# Altium project УШЯИ 687253.017 Э3.PrjPcb
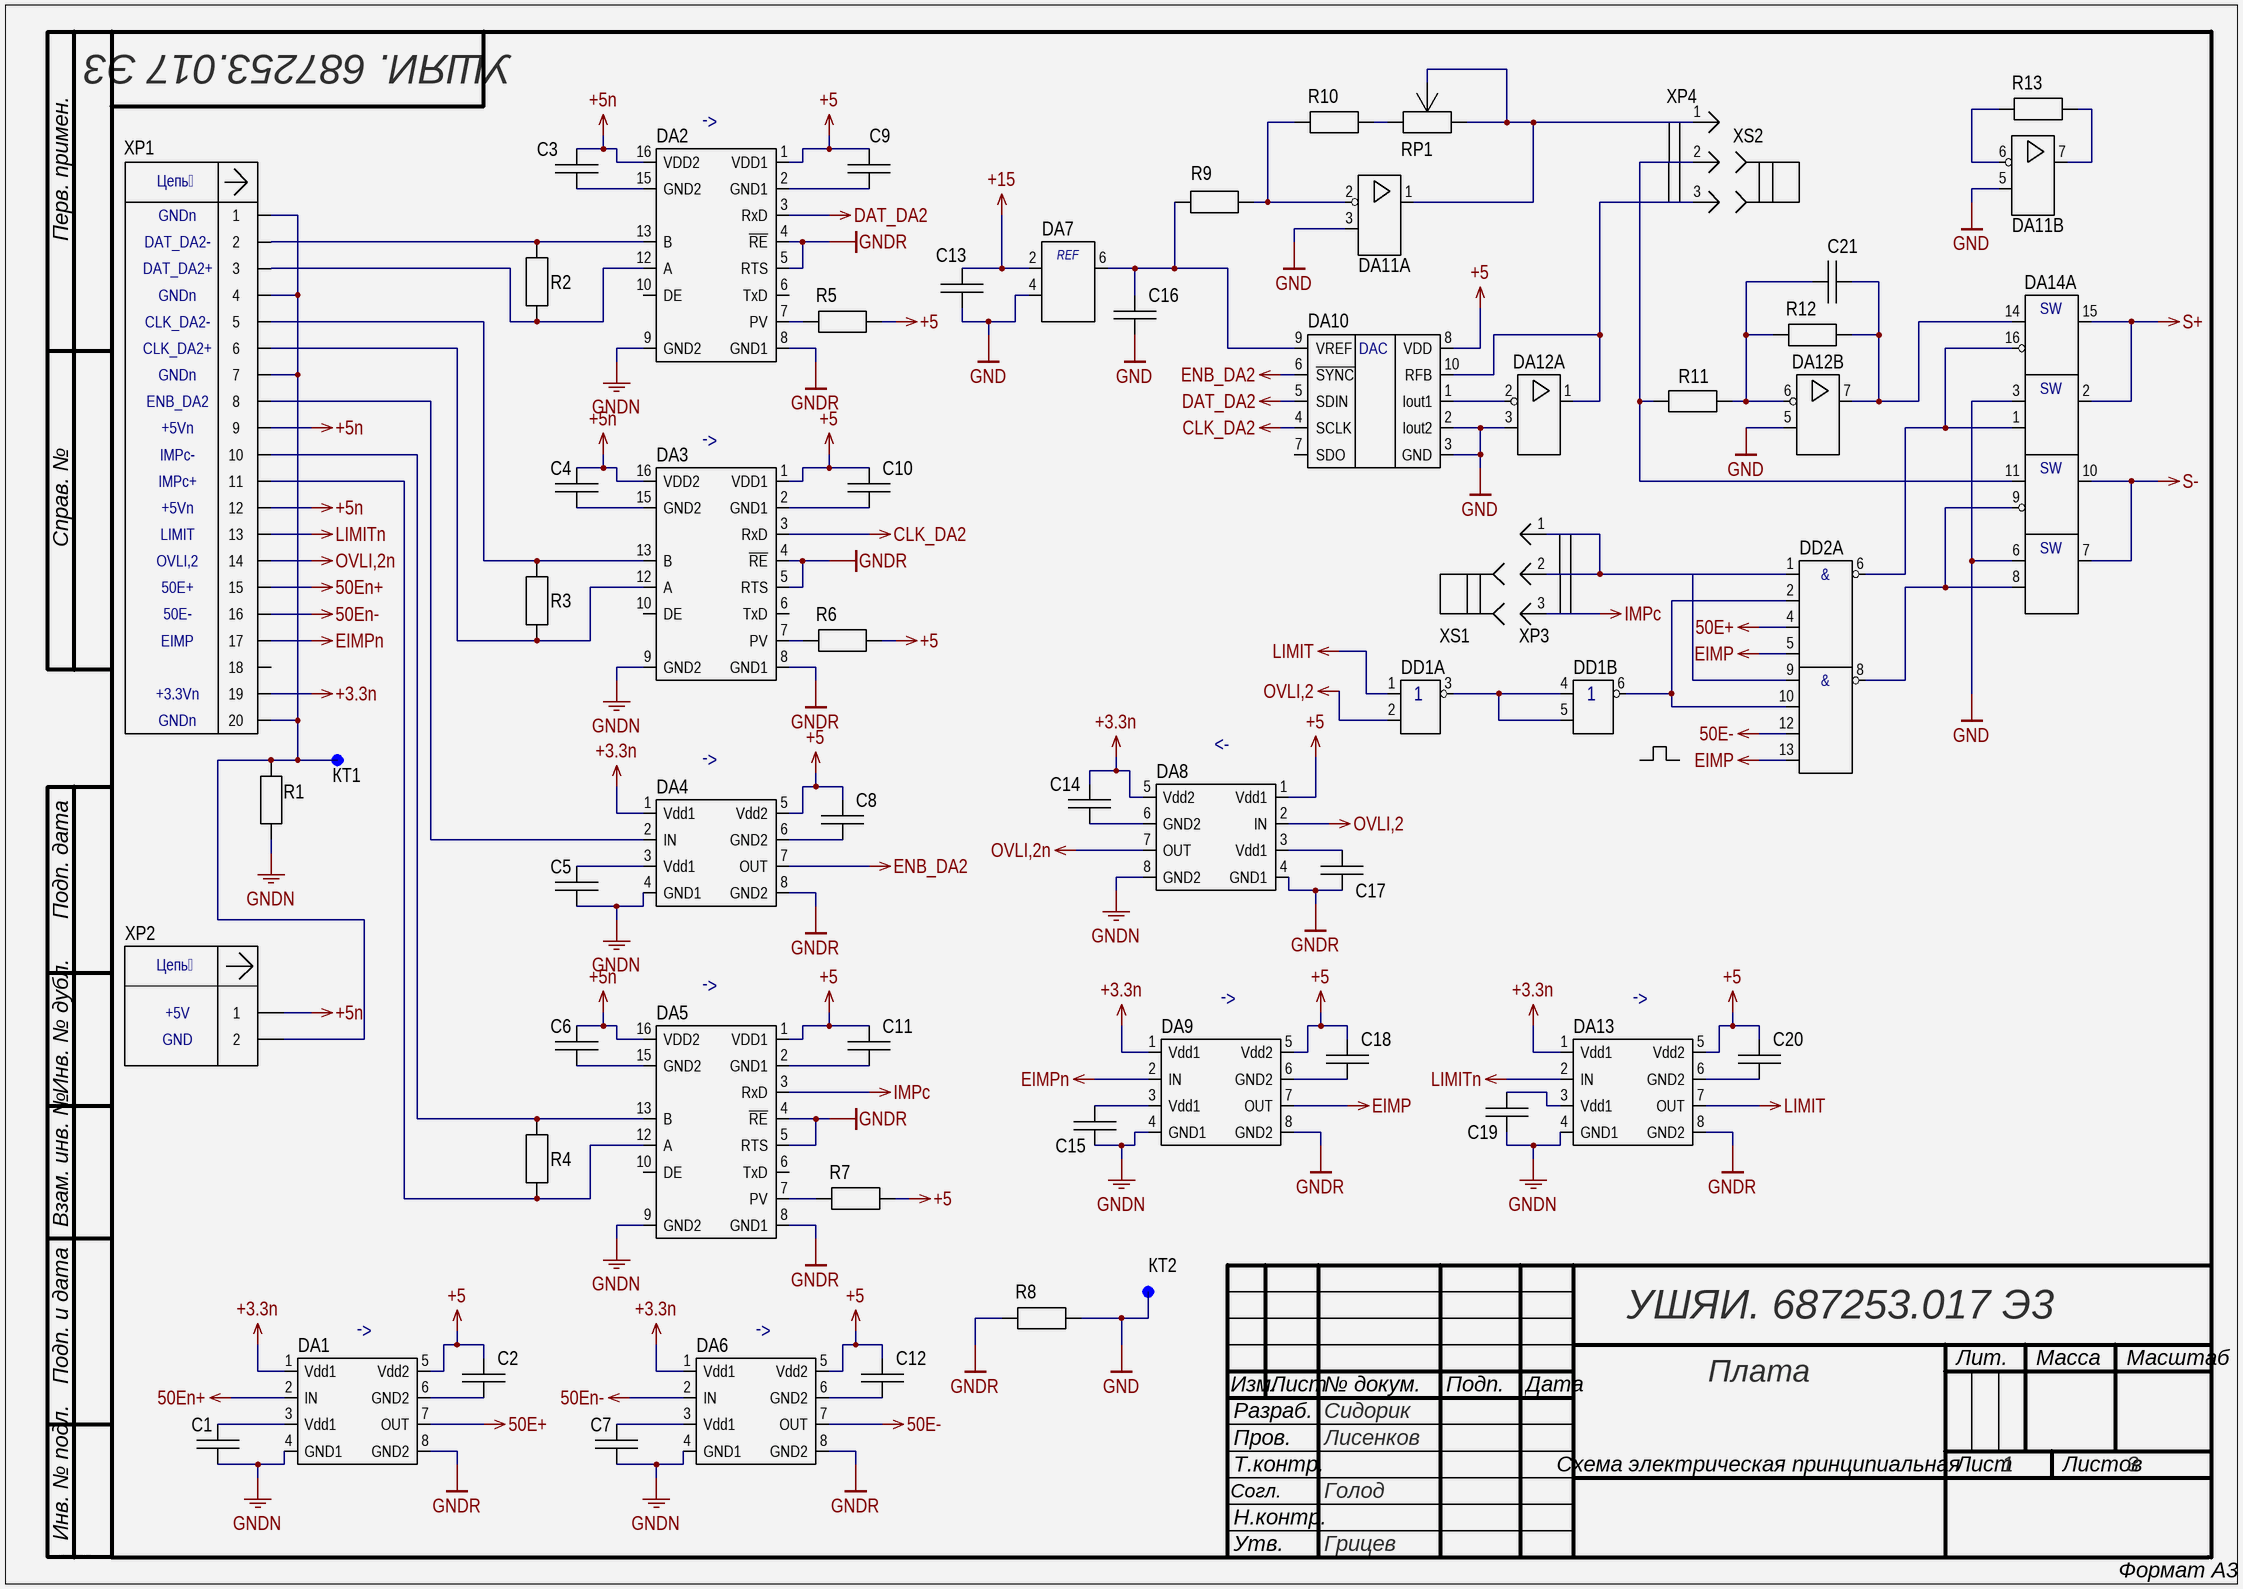
[diagram p0: Sheet1.SchDoc]
Вид_документа_SCH: Схема электрическая принципиальная; Наименование1: Плата; Обозначение_Код: УШЯИ. 687253.017 Э3; Характер_работы: Согл.; п_Доп_графа_Р: Голод; п_Пров_Р: Лисенков; п_Разраб_Р: Сидорик; п_Утв_Р: Грицев
2 sheets, 132 parts. Net scope: global (net labels, ports and power ports of the same name join across sheets).
Board files: PCB1.PcbDoc, PCB2.PcbDoc
Sheets:
  Sheet1.SchDoc
  Sheet2.SchDoc

## Sheet Sheet1.SchDoc
size 420 x 297 mm; SheetNumber: 1; SheetTotal: 3

### Parts
C1  0805-X7R-25 В-0,1 мкФ +-10%  [CAP: 0805]  (value not drawn)
C2  0805-X7R-25 В-0,1 мкФ +-10%  [CAP: 0805]  (value not drawn)
C3  0805-X7R-25 В-0,1 мкФ +-10%  [CAP: 0805]  (value not drawn)
C4  0805-X7R-25 В-0,1 мкФ +-10%  [CAP: 0805]  (value not drawn)
C5  0805-X7R-25 В-0,1 мкФ +-10%  [CAP: 0805]  (value not drawn)
C6  0805-X7R-25 В-0,1 мкФ +-10%  [CAP: 0805]  (value not drawn)
C7  0805-X7R-25 В-0,1 мкФ +-10%  [CAP: 0805]  (value not drawn)
C8  0805-X7R-25 В-0,1 мкФ +-10%  [CAP: 0805]  (value not drawn)
C9  0805-X7R-25 В-0,1 мкФ +-10%  [CAP: 0805]  (value not drawn)
C10  0805-X7R-25 В-0,1 мкФ +-10%  [CAP: 0805]  (value not drawn)
C11  0805-X7R-25 В-0,1 мкФ +-10%  [CAP: 0805]  (value not drawn)
C12  0805-X7R-25 В-0,1 мкФ +-10%  [CAP: 0805]  (value not drawn)
C13  0805-X7R-25 В-0,1 мкФ +-10%  [CAP: 0805]  (value not drawn)
C14  0805-X7R-25 В-0,1 мкФ +-10%  [CAP: 0805]  (value not drawn)
C15  0805-X7R-25 В-0,1 мкФ +-10%  [CAP: 0805]  (value not drawn)
C16  0805-X7R-25 В-0,1 мкФ +-10%  [CAP: 0805]  (value not drawn)
C17  0805-X7R-25 В-0,1 мкФ +-10%  [CAP: 0805]  (value not drawn)
C18  0805-X7R-25 В-0,1 мкФ +-10%  [CAP: 0805]  (value not drawn)
C19  0805-X7R-25 В-0,1 мкФ +-10%  [CAP: 0805]  (value not drawn)
C20  0805-X7R-25 В-0,1 мкФ +-10%  [CAP: 0805]  (value not drawn)
C21  1206-C0G-50 В-22 пФ +-5%  [CAP: 1206]  (value not drawn)
DA1  ADuM1100AR  [8-SOIC]  (value not drawn)
DA2  ADM2486BRWZ  [16-SOIC W]  (value not drawn)
DA3  ADM2486BRWZ  [16-SOIC W]  (value not drawn)
DA4  ADuM1100AR  [8-SOIC]  (value not drawn)
DA5  ADM2486BRWZ  [16-SOIC W]  (value not drawn)
DA6  ADuM1100AR  [8-SOIC]  (value not drawn)
DA7  ADR435BRZ  [8-SOIC]  (value not drawn)
DA8  ADuM1100AR  [8-SOIC]  (value not drawn)
DA9  ADuM1100AR  [8-SOIC]  (value not drawn)
DA10  AD5443YRM  [10-MSOP]  (value not drawn)
DA11  ADA4084-2ARZ  [8-SOIC]  (value not drawn)  (parts A,B of 3)
DA12  ADA4084-2ARZ  [8-SOIC]  (value not drawn)  (parts A,B of 3)
DA13  ADuM1100AR  [8-SOIC]  (value not drawn)
DA14  ADG433BR  [16-SOIC]  (value not drawn)  (part A of 2)
DD1  IN74HC00AD  [14-soic]  (value not drawn)  (parts A,B of 5)
DD2  IN74HC20D  [14-SOIC]  (value not drawn)  (part A of 2)
R1  1206-10 Ом+-5%  [1206]  (value not drawn)
R2  1206-100 Ом+-5%  [1206]  (value not drawn)
R3  1206-100 Ом+-5%  [1206]  (value not drawn)
R4  1206-100 Ом+-5%  [1206]  (value not drawn)
R5  1206-12 кОм+-5%  [1206]  (value not drawn)
R6  1206-12 кОм+-5%  [1206]  (value not drawn)
R7  1206-12 кОм+-5%  [1206]  (value not drawn)
R8  1206-10 Ом+-5%  [1206]  (value not drawn)
R9  1206-10 кОм+-0,5%  [1206]  (value not drawn)
R10  1206-100 Ом+-0,5%  [1206]  (value not drawn)
R11  1206-10 кОм+-0,5%  [1206]  (value not drawn)
R12  1206-10 кОм+-0,5%  [1206]  (value not drawn)
R13  1206-12 кОм+-1%  [1206]  (value not drawn)
RP1  3362P-1-103LF  [BOUR-3362P]  (value not drawn)
XP1  BH2-20  [DS1014-20]  (value not drawn)
XP2  280370-2  [280370-2]  (value not drawn)
XP3  DS1021-1x3  [3X2.54]  (value not drawn)
XP4  DS1021-1x3  [3X2.54]  (value not drawn)
XS1  Jumper, 2.54mm  (value not drawn)
XS2  Jumper, 2.54mm  (value not drawn)
КТ1  Lepestok  [LEPESTOK7750224]  (value not drawn)
КТ2  Lepestok  [LEPESTOK7750224]  (value not drawn)

### Nets
50E+: DA1.7(OUT) DD2.4(C1)
50E-: DA6.7(OUT) DD2.12(C2)
50En+: DA1.2(IN) XP1.15
50En-: DA6.2(IN) XP1.16
+3.3n: C14.1 DA1.1(Vdd1) DA4.1(Vdd1) DA6.1(Vdd1) DA8.5(Vdd2) DA9.1(Vdd1) DA13.1(Vdd1) XP1.19
+5: C2.1 C8.1 C9.2 C10.2 C11.2 C12.1 C18.1 C20.1 DA1.5(Vdd2) DA2.1(VDD1) DA3.1(VDD1) DA4.5(Vdd2) DA5.1(VDD1) DA6.5(Vdd2) DA8.1(Vdd1) DA9.5(Vdd2) DA10.8(VDD) DA13.5(Vdd2) R5.1 R6.1 R7.1
+5n: C3.2 C4.2 C6.2 DA2.16(VDD2) DA3.16(VDD2) DA5.16(VDD2) XP1.9 XP1.12 XP2.1
+15: C13.1 DA7.2(VIN)
CLK_DA2: DA3.3(RxD) DA10.4(SCLK)
DAT_DA2: DA2.3(RxD) DA10.5(SDIN)
EIMP: DA9.7(OUT) DD2.5(D1) DD2.13(D2)
EIMPn: DA9.2(IN) XP1.17
ENB_DA2: DA4.7(OUT) DA10.6(~{SYNC})
GND: C13.2 C16.1 DA7.4(GND) DA10.2(Iout2) DA10.3(GND) DA11.3(+IN_A) DA11.5(+IN_B) DA12.3(+IN_A) DA12.5(+IN_B) DA14.3(S1) DA14.6(S4) R8.2 КТ2.1
GNDN: C1.1 C5.1 C7.1 C15.1 C19.1 DA1.4(GND1) DA2.9(GND2) DA3.9(GND2) DA4.4(GND1) DA5.9(GND2) DA6.4(GND1) DA8.8(GND2) DA9.4(GND1) DA13.4(GND1) R1.1
GNDR: C17.1 DA1.8(GND2) DA2.4(~{RE}) DA2.5(RTS) DA2.8(GND1) DA3.4(~{RE}) DA3.5(RTS) DA3.8(GND1) DA4.8(GND2) DA5.4(~{RE}) DA5.5(RTS) DA5.8(GND1) DA6.8(GND2) DA8.4(GND1) DA9.8(GND2) DA13.8(GND2) R8.1
IMPc: DA5.3(RxD) XP3.3
LIMIT: DA13.7(OUT) DD1.1(A1)
LIMITn: DA13.2(IN) XP1.13
OVLI,2: DA8.2(IN) DD1.2(B1)
OVLI,2n: DA8.7(OUT) XP1.14
S+: DA14.2(D1) DA14.15(D2)
S-: DA14.7(D4) DA14.10(D3)
NetC1_2: C1.2 DA1.3(Vdd1)
NetC2_2: C2.2 DA1.6(GND2)
NetC3_1: C3.1 DA2.15(GND2)
NetC4_1: C4.1 DA3.15(GND2)
NetC5_2: C5.2 DA4.3(Vdd1)
NetC6_1: C6.1 DA5.15(GND2)
NetC7_2: C7.2 DA6.3(Vdd1)
NetC8_2: C8.2 DA4.6(GND2)
NetC9_1: C9.1 DA2.2(GND1)
NetC10_1: C10.1 DA3.2(GND1)
NetC11_1: C11.1 DA5.2(GND1)
NetC12_2: C12.2 DA6.6(GND2)
NetC14_2: C14.2 DA8.6(GND2)
NetC15_2: C15.2 DA9.3(Vdd1)
NetC16_2: C16.2 DA7.6(VOUT) DA10.9(VREF) R9.1
NetC17_2: C17.2 DA8.3(Vdd1)
NetC18_2: C18.2 DA9.6(GND2)
NetC19_2: C19.2 DA13.3(Vdd1)
NetC20_2: C20.2 DA13.6(GND2)
NetC21_1: C21.1 DA12.6(-IN_B) R11.2 R12.1
NetC21_2: C21.2 DA12.7(OUT_B) DA14.14(S2) R12.2
NetDA2_7: DA2.7(PV) R5.2
NetDA2_12: DA2.12(A) R2.1 XP1.3
NetDA2_13: DA2.13(B) R2.2 XP1.2
NetDA3_7: DA3.7(PV) R6.2
NetDA3_12: DA3.12(A) R3.1 XP1.6
NetDA3_13: DA3.13(B) R3.2 XP1.5
NetDA4_2: DA4.2(IN) XP1.8
NetDA5_7: DA5.7(PV) R7.2
NetDA5_12: DA5.12(A) R4.1 XP1.11
NetDA5_13: DA5.13(B) R4.2 XP1.10
NetDA10_1: DA10.1(Iout1) DA12.2(-IN_A)
NetDA10_10: DA10.10(RFB) DA12.1(OUT_A) XP4.3
NetDA11_1: DA11.1(OUT_A) RP1.1 RP1.2(WIPER) XP4.1
NetDA11_2: DA11.2(-IN_A) R9.2 R10.1
NetDA11_6: DA11.6(-IN_B) R13.1
NetDA11_7: DA11.7(OUT_B) R13.2
NetDA14_1: DA14.1(IN1) DA14.16(IN2) DD2.6(Y1)
NetDA14_8: DA14.8(IN4) DA14.9(IN3) DD2.8(Y2)
NetDA14_11: DA14.11(S3) R11.1 XP4.2
NetDD1_3: DD1.3(Y1) DD1.4(A2) DD1.5(B2)
NetDD1_6: DD1.6(Y2) DD2.2(B1) DD2.10(B2)
NetDD2_1: DD2.1(A1) DD2.9(A2) XP3.1 XP3.2
NetR1_2: R1.2 XP1.1 XP1.4 XP1.7 XP1.20 XP2.2 КТ1.1
NetR10_2: R10.2 RP1.3

Not connected (* = marked no-connect by the designer): DA2 6(TxD) 10(DE); DA3 6(TxD) 10(DE); DA5 6(TxD) 10(DE); DA10 7(SDO); XP1 18

### Notes on the sheet
- (near DA2) <-
- (near XP1) DAT_DA2-
- GNDn
- (near XP1) 1
- (near XP1) 2
- (near XP1) DAT_DA2+
- (near XP1) CLK_DA2-
- (near XP1) 3
- (near XP1) 4
- (near XP1) 5
- (near XP1) CLK_DA2+
- (near XP1) ENB_DA2
- (near XP1) 6
- (near XP1) 7
- (near XP1) 8
- IMPc-
- +5Vn
- (near XP1) 9
- (near XP1) 10
- (near DA3) <-
- IMPc+
- LIMIT
- (near XP1) 11
- (near XP1) 12
- (near XP1) 13
- OVLI,2
- 50E+
- (near XP1) 14
- (near XP1) 15
- EIMP
- 50E-
- (near XP1) 16
- (near XP1) 17
- (near XP1) 18
- +3.3Vn
- (near XP1) 19
- (near XP1) 20
- (near DA4) <-
- (near DA8) <-
- (near DA5) <-
- (near DA9) <-
- (near DA13) <-
- +5V
- GND
- (near DA1) <-
- (near DA6) <-
- Перв. примен.
- Справ. №
- Подп. дата
- Инв. № дубл.
- Взам. инв. №
- Подп. и дата
- Изм.
- Разраб.
- Лист
- № докум.
- Подп.
- Дата
- Лит.
- Масса
- Масштаб
- Пров.
- Т.контр.
- Листов
- Инв. № подл.
- Н.контр.
- Утв.
- ALTIUM GOSTBOM2.0 KEV
- Формат А3
- (in symbol 280370-2) Цепь
- (in symbol AD5443YRM) DAC
- (in symbol ADG433BR_1, part A) SW
- (in symbol ADR435BRZ) REF
- (in symbol BH2-20) Цепь
- (in symbol IN74HC20D_1, part A) &

### Library data of the parts
C1-C20 = 0805-X7R-25 В-0,1 мкФ +-10%: Value: 0,1 мкФ
C21 = 1206-C0G-50 В-22 пФ +-5%: Value: 22 пФ
DA2 DA3 DA5 = ADM2486BRWZ: Isolated RS-485 Transceiver,  20 Mbps data rate, SOIC-16-W
DA10 = AD5443YRM: 12-Bit High Bandwidth / Multiplying DACs with Serial Interface / 10-MSOP
DA11 DA12 = ADA4084-2ARZ: 30 V, Low Noise, Rail-to-Rail Input/Output, / Low Power Operational Amplifiers
DA14 = ADG433BR_1: LC2MOS Precision Quad SPST Switches; Value: *
DD1 = IN74HC00AD: Quad 2-Input NAND Gate High-Performance Silicon-Gate CMOS.
DD2 = IN74HC20D_1: Dual 4-input  NAND Gate CMOS
R1 R8 = 1206-10 Ом+-5%: Value: 10 Ом; ModelPrint: 1206
R2-R4 = 1206-100 Ом+-5%: Value: 100 Ом; ModelPrint: 1206
R5-R7 = 1206-12 кОм+-5%: Value: 12 кОм; ModelPrint: 1206
R9 R11 R12 = 1206-10 кОм+-0,5%: Value: 10 кОм; ModelPrint: 1206
R10 = 1206-100 Ом+-0,5%: Value: 100 Ом; ModelPrint: 1206
R13 = 1206-12 кОм+-1%: Value: 12 кОм; ModelPrint: 1206
RP1 = 3362P-1-103LF: 3362 -1/4 ˝ Square Trimpot® Trimming Potentiometer
XP1 = BH2-20: IDC2-20MS DS1014 20 pin
XP2 = 280370-2: Connector
XP3 XP4 = DS1021-1x3_1: PLS-3, 2.54 pitch; 1: *; 2: *; 3: *

## Sheet Sheet2.SchDoc
size 420 x 297 mm; SheetNumber: 2; SheetTotal: 3
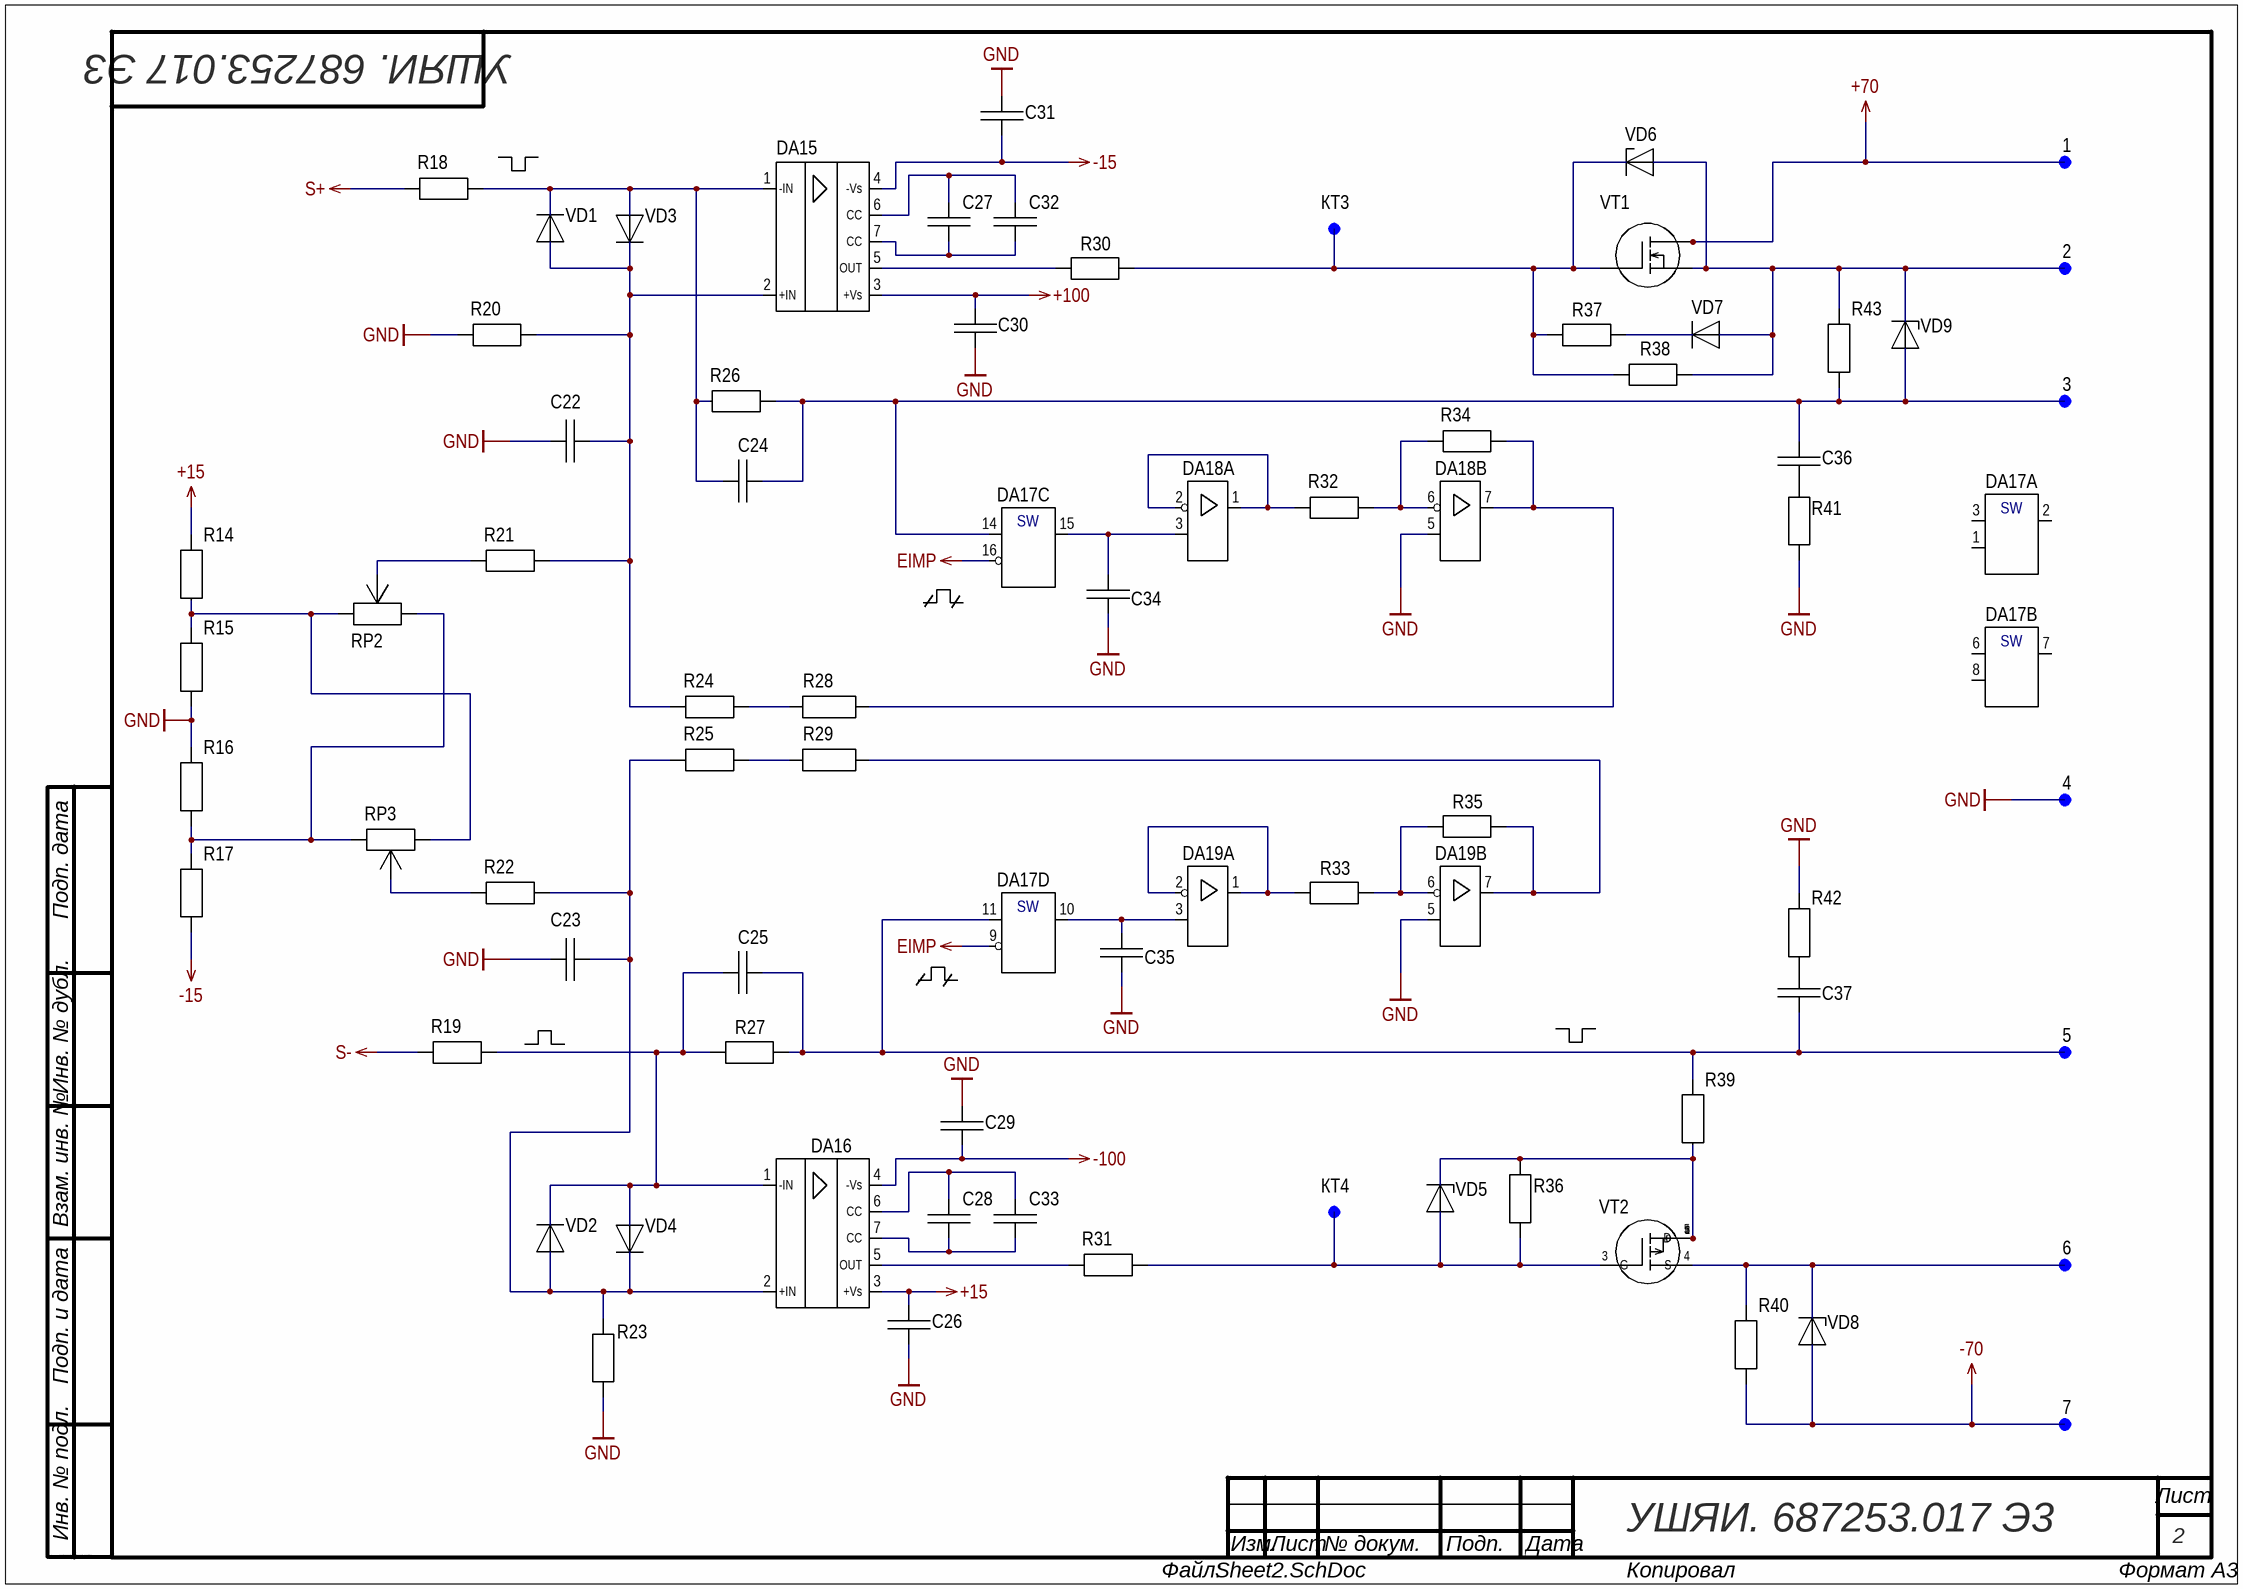
[diagram p1: Sheet2.SchDoc]

### Parts
1  OTV  (value not drawn)
2  OTV  (value not drawn)
3  OTV  (value not drawn)
4  OTV  (value not drawn)
5  OTV  (value not drawn)
6  OTV  (value not drawn)
7  OTV  (value not drawn)
C22  2220-X7R-250 В-1 мкФ +-10%  [CAP: 2220]  (value not drawn)
C23  2220-X7R-250 В-1 мкФ +-10%  [CAP: 2220]  (value not drawn)
C24  0805-C0G-250 В-10 пФ +-5%  [CAP: 0805]  (value not drawn)
C25  0805-C0G-250 В-10 пФ +-5%  [CAP: 0805]  (value not drawn)
C26  0805-X7R-25 В-1 мкФ +-10%  [CAP: 0805]  (value not drawn)
C27  0805-C0G-250 В-10 пФ +-5%  [CAP: 0805]  (value not drawn)
C28  0805-C0G-250 В-10 пФ +-5%  [CAP: 0805]  (value not drawn)
C29  2220-X7R-250 В-1 мкФ +-10%  [CAP: 2220]  (value not drawn)
C30  2220-X7R-250 В-1 мкФ +-10%  [CAP: 2220]  (value not drawn)
C31  0805-X7R-25 В-1 мкФ +-10%  [CAP: 0805]  (value not drawn)
C32  0805-C0G-250 В-10 пФ +-5%  [CAP: 0805]  (value not drawn)
C33  0805-C0G-250 В-10 пФ +-5%  [CAP: 0805]  (value not drawn)
C34  К73-17-160 В-1 мкФ +-10%  [К73-17-A15]  (value not drawn)
C35  К73-17-160 В-1 мкФ +-10%  [К73-17-A15]  (value not drawn)
C36  1206-X7R-250 B-0,1 мкФ+-10%  [CAP: 1206]  (value not drawn)
C37  1206-X7R-250 B-0,1 мкФ+-10%  [CAP: 1206]  (value not drawn)
DA15  PA340CC  [D2PAK (TO263-7-1)]  (value not drawn)
DA16  PA340CC  [D2PAK (TO263-7-1)]  (value not drawn)
DA17  ADG433BR  [16-SOIC]  (value not drawn)  (parts A,B,C,D of 5)
DA18  AD823ARZ  [8-SOIC]  (value not drawn)  (parts A,B of 3)
DA19  AD823ARZ  [8-SOIC]  (value not drawn)  (parts A,B of 3)
R14  1206-15 кОм+-5%  [1206]  (value not drawn)
R15  1206-51 Ом+-5%  [1206]  (value not drawn)
R16  1206-51 Ом+-5%  [1206]  (value not drawn)
R17  1206-51 кОм+-5%  [1206]  (value not drawn)
R18  1206-2 кОм+-0.5%  [1206]  (value not drawn)
R19  1206-2 кОм+-0.5%  [1206]  (value not drawn)
R20  1206-2 кОм+-0.5%  [1206]  (value not drawn)
R21  1206-2 кОм+-0.5%  [1206]  (value not drawn)
R22  1206-2 кОм+-0.5%  [1206]  (value not drawn)
R23  1206-2 кОм+-0.5%  [1206]  (value not drawn)
R24  1206-10 кОм+-0,5%  [1206]  (value not drawn)
R25  1206-10 кОм+-0,5%  [1206]  (value not drawn)
R26  1206-20 кОм+-0.5%  [1206]  (value not drawn)
R27  1206-20 кОм+-0.5%  [1206]  (value not drawn)
R28  С2-33Н-0,125-1,5 кОм +-5%  [RES_AXIAL_VERTICAL_5mm]  (value not drawn)
R29  С2-33Н-0,125-1,5 кОм +-5%  [RES_AXIAL_VERTICAL_5mm]  (value not drawn)
R30  1206-2,4 кОм+-5%  [1206]  (value not drawn)
R31  1206-2,4 кОм+-5%  [1206]  (value not drawn)
R32  1206-20 кОм+-0.5%  [1206]  (value not drawn)
R33  1206-20 кОм+-0.5%  [1206]  (value not drawn)
R34  1206-20 кОм+-0.5%  [1206]  (value not drawn)
R35  1206-20 кОм+-0.5%  [1206]  (value not drawn)
R36  1206-2,4 кОм+-5%  [1206]  (value not drawn)
R37  1206-51 Ом+-5%  [1206]  (value not drawn)
R38  1206-2,4 кОм+-5%  [1206]  (value not drawn)
R39  1206-51 Ом+-5%  [1206]  (value not drawn)
R40  2512-51 Ом+-5%  [2512]  (value not drawn)
R41  2512-51 Ом+-5%  [2512]  (value not drawn)
R42  2512-51 Ом+-5%  [2512]  (value not drawn)
R43  2512-51 Ом+-5%  [2512]  (value not drawn)
RP2  PVG3A102C01R00  [PVG3A]  (value not drawn)
RP3  PVG3A102C01R00  [PVG3A]  (value not drawn)
VD1  1N4148  [DO-35 vertical]  (value not drawn)
VD2  1N4148  [DO-35 vertical]  (value not drawn)
VD3  1N4148  [DO-35 vertical]  (value not drawn)
VD4  1N4148  [DO-35 vertical]  (value not drawn)
VD5  BZX84C15LT1G  [SOT-23-3]  (value not drawn)
VD6  BZX84C15LT1G  [SOT-23-3]  (value not drawn)
VD7  1N4148  [DO-35 vertical]  (value not drawn)
VD8  BZX84C15LT1G  [SOT-23-3]  (value not drawn)
VD9  BZX84C15LT1G  [SOT-23-3]  (value not drawn)
VT1  ZXMN10A08E6TA  [SOT-23-6]  (value not drawn)
VT2  ZXMP10A17E6TA  [SOT-23-6]  (value not drawn)
КТ3  Lepestok  [LEPESTOK7750224]  (value not drawn)
КТ4  Lepestok  [LEPESTOK7750224]  (value not drawn)

### Nets
+15: C26.2 DA16.3(+Vs) R14.2
+70: 1.?1 VT1.1(D) VT1.2(D) VT1.5(D) VT1.6(D)
+100: C30.2 DA15.3(+Vs)
-15: C31.1 DA15.4(-Vs) R17.1
-70: 7.?1 R40.1 VD8.1
-100: C29.1 DA16.4(-Vs)
EIMP: DA17.9(IN3) DA17.16(IN2)
GND: 4.?1 C22.1 C23.1 C26.1 C29.2 C30.1 C31.2 C34.1 C35.1 DA18.5(+IN2) DA19.5(+IN2) R15.1 R16.2 R20.1 R23.1 R41.2 R42.2
S+: R18.1
S-: R19.1
Net2_?1: 2.?1 R38.2 R43.2 VD6.1 VD7.1 VD9.3 VT1.4(S)
Net3_?1: 3.?1 C24.2 C36.2 DA17.14(S2) R26.2 R43.1 VD9.1
Net5_?1: 5.?1 C25.2 C37.2 DA17.11(S3) R27.2 R39.2
Net6_?1: 6.?1 R40.2 VD8.3 VT2.4(S)
NetC22_2: C22.2 DA15.2(+IN) R20.2 R21.2 R24.1 VD1.1 VD3.2
NetC23_2: C23.2 DA16.2(+IN) R22.2 R23.2 R25.1 VD2.1 VD4.2
NetC24_1: C24.1 DA15.1(-IN) R18.2 R26.1 VD1.2 VD3.1
NetC25_1: C25.1 DA16.1(-IN) R19.2 R27.1 VD2.2 VD4.1
NetC27_1: C27.1 C32.1 DA15.7(СС)
NetC27_2: C27.2 C32.2 DA15.6(СС)
NetC28_1: C28.1 C33.1 DA16.7(СС)
NetC28_2: C28.2 C33.2 DA16.6(СС)
NetC34_2: C34.2 DA17.15(D2) DA18.3(+IN1)
NetC35_2: C35.2 DA17.10(D3) DA19.3(+IN1)
NetC36_1: C36.1 R41.1
NetC37_1: C37.1 R42.1
NetDA15_5: DA15.5(OUT) R30.1
NetDA16_5: DA16.5(OUT) R31.1
NetDA18_1: DA18.1(OUT1) DA18.2(-IN1) R32.1
NetDA18_6: DA18.6(-IN2) R32.2 R34.1
NetDA18_7: DA18.7(OUT2) R28.2 R34.2
NetDA19_1: DA19.1(OUT1) DA19.2(-IN1) R33.1
NetDA19_6: DA19.6(-IN2) R33.2 R35.1
NetDA19_7: DA19.7(OUT2) R29.2 R35.2
NetR14_1: R14.1 R15.2 RP2.3 RP3.3
NetR16_1: R16.1 R17.2 RP2.1 RP3.1
NetR21_1: R21.1 RP2.2(WIPER)
NetR22_1: R22.1 RP3.2(WIPER)
NetR24_2: R24.2 R28.1
NetR25_2: R25.2 R29.1
NetR30_2: R30.2 R37.1 R38.1 VD6.3 VT1.3(G) КТ3.1
NetR31_2: R31.2 R36.1 VD5.1 VT2.3(G) КТ4.1
NetR36_2: R36.2 R39.1 VD5.3 VT2.1(D) VT2.2(D) VT2.5(D) VT2.6(G)
NetR37_2: R37.2 VD7.2

Not connected (* = marked no-connect by the designer): DA17 1(IN1) 2(D1) 3(S1) 6(S4) 7(D4) 8(IN4)

### Notes on the sheet
- Подп. дата
- Инв. № дубл.
- Взам. инв. №
- Подп. и дата
- Инв. № подл.
- Изм.
- Лист
- № докум.
- Подп.
- Дата
- ALTIUM GOSTBOM2.0 KEV
- Файл:
- Копировал
- Формат А3
- (in symbol ADG433BR, part A) SW
- (in symbol ADG433BR, part B) SW
- (in symbol ADG433BR, part C) SW
- (in symbol ADG433BR, part D) SW

### Library data of the parts
C22 C23 C29 C30 = 2220-X7R-250 В-1 мкФ +-10%: Value: 1 мкФ
C24 C25 C27 C28 C32 C33 = 0805-C0G-250 В-10 пФ +-5%: Value: 10 пФ
C26 C31 = 0805-X7R-25 В-1 мкФ +-10%: Value: 1 мкФ
C36 C37 = 1206-X7R-250 B-0,1 мкФ+-10%: Value: 2,2 пФ
DA15 DA16 = PA340CC: High Voltage Power Operational Amplifier
DA17 = ADG433BR: LC2MOS Precision Quad SPST Switches; Value: *
DA18 DA19 = AD823ARZ: Dual, 16 MHz, Rail-to-Rail / FET Input Amplifier / 8-SOIC
R14 = 1206-15 кОм+-5%: Value: 15 кОм; ModelPrint: 1206
R15 R16 R37 R39 = 1206-51 Ом+-5%: Value: 51 Ом; ModelPrint: 1206
R17 = 1206-51 кОм+-5%: Value: 51 кОм; ModelPrint: 1206
R18-R23 = 1206-2 кОм+-0.5%: Value: 2 кОм; ModelPrint: 1206
R24 R25 = 1206-10 кОм+-0,5%: Value: 10 кОм; ModelPrint: 1206
R26 R27 R32-R35 = 1206-20 кОм+-0.5%: Value: 20 кОм; ModelPrint: 1206
R28 R29 = С2-33Н-0,125-1,5 кОм +-5%: Резисторы постоянные непроволочные общего применения С2-33Н АИ, производитель "АО"НПО"ЭРКОН"; Номинальная мощность рассеяния: 0,125 Вт; Диапазон значений номинальных сопротивлений: от 1 Ом до 3,01 МОм; Ряд сопротивлений: Е24, Е96; Категории качества: «ОТК»; ТУ: ОЖО.467.173 ТУ; Value: *
R30 R31 R36 R38 = 1206-2,4 кОм+-5%: Value: 2,4 кОм; ModelPrint: 1206
R40-R43 = 2512-51 Ом+-5%: Value: 51 Ом; ModelPrint: 2512
VD1-VD4 VD7 = 1N4148: Диод 1N4148; Value: *
VT1 = ZXMN10A08E6TA: MOSFET, N, SOT-23-6; Transistor Type: MOSFET; Transistor Polarity: N; Voltage, Vds Typ: 100V; Current, Id Cont: 1.5A;
VT2 = ZXMP10A17E6TA: P-Channel 100 V 0.35 Ohm Power MOSFET Surface Mount - SOT-23-6

## Nets that join several sheets
+15: Sheet1 (C13.1 DA7.2), Sheet2 (C26.2 DA16.3 R14.2)
EIMP: Sheet1 (DA9.7 DD2.5 DD2.13), Sheet2 (DA17.9 DA17.16)
GND: Sheet1 (13 pins), Sheet2 (17 pins)
S+: Sheet1 (DA14.2 DA14.15), Sheet2 (R18.1)
S-: Sheet1 (DA14.7 DA14.10), Sheet2 (R19.1)